# EAGLE schematic SparkFunLargeDigitDriver (EAGLE 7.2.0)
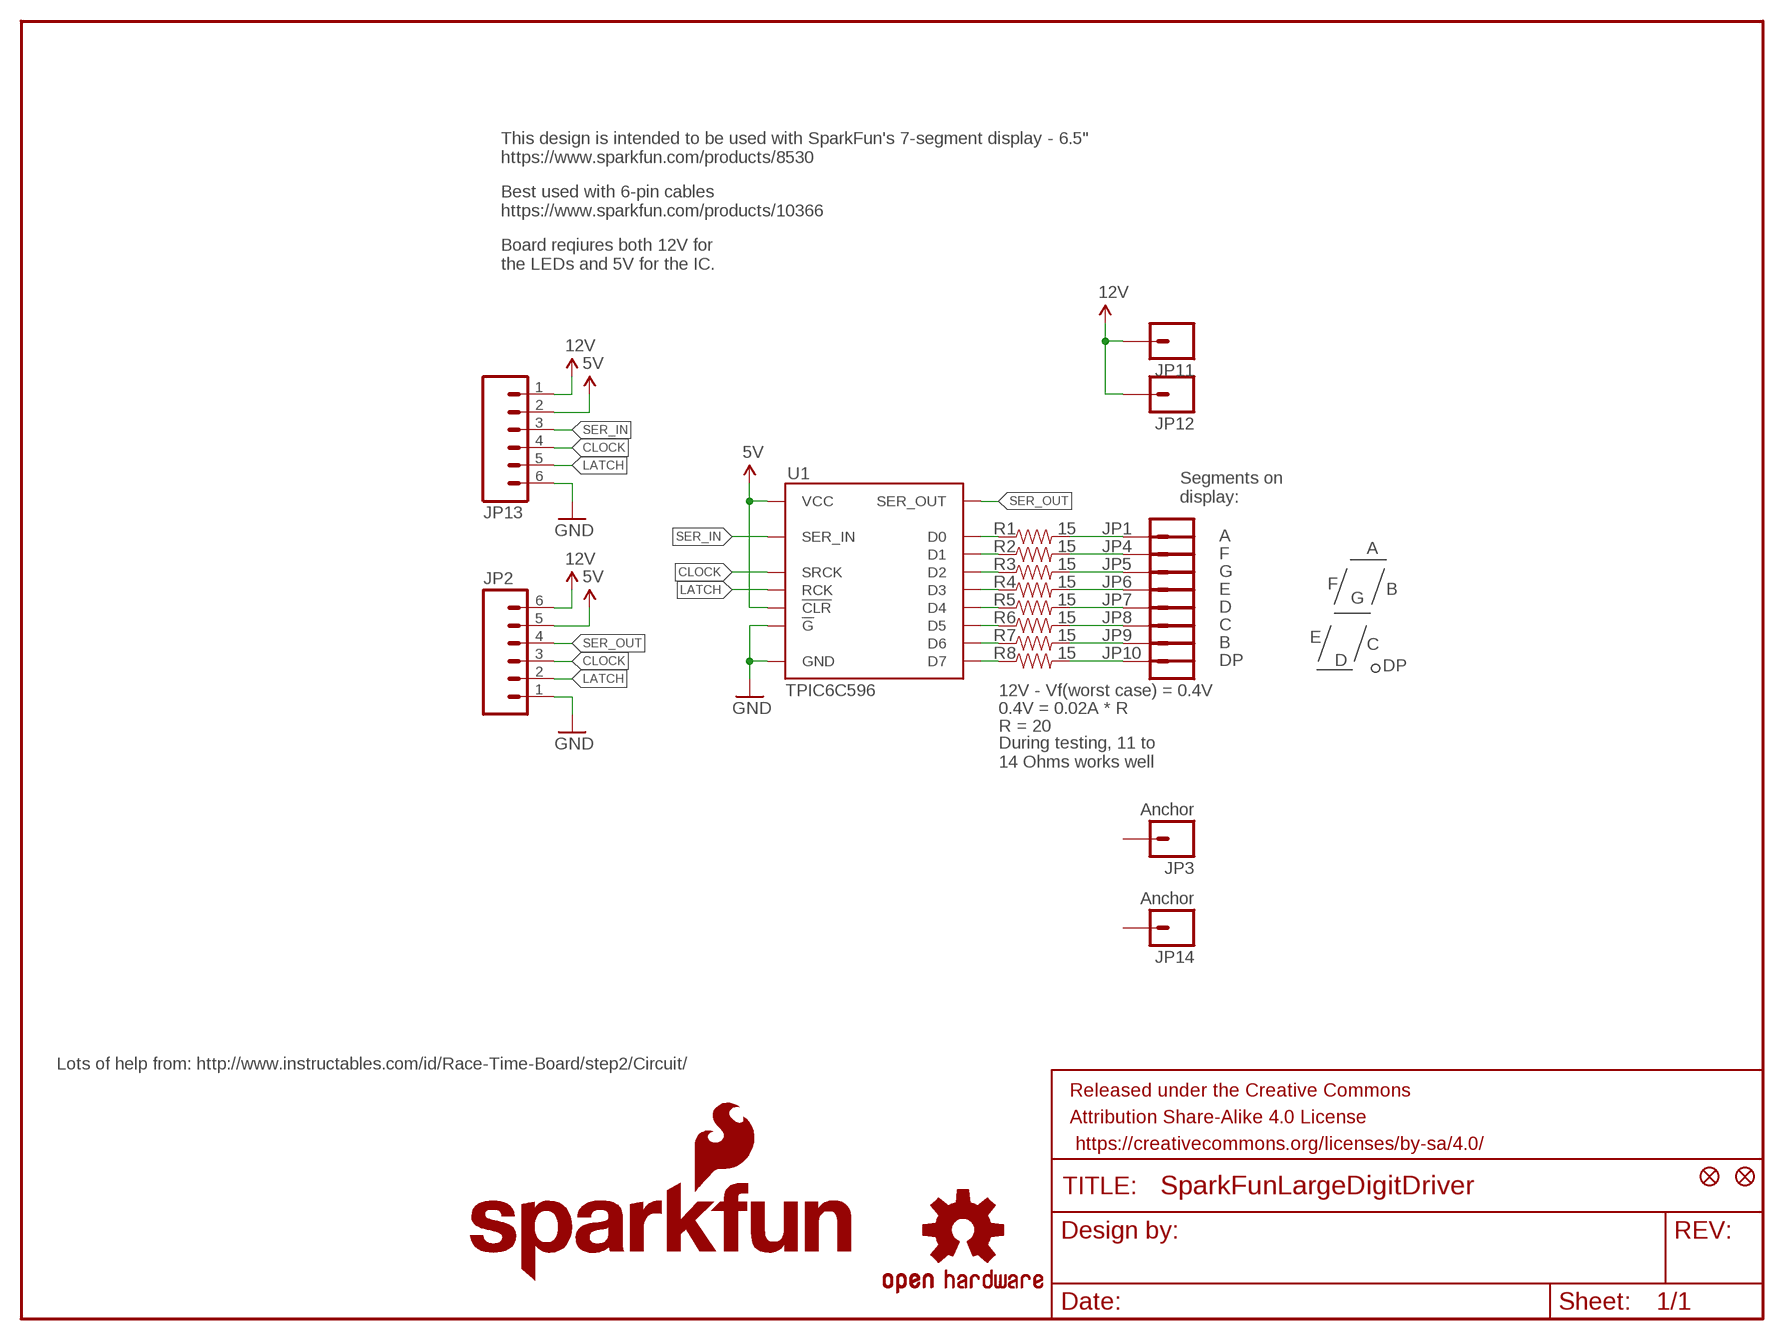
[diagram p0: schematic, sheet 1]

## Parts
FID1  FIDUCIAL1X2  [FIDUCIAL-1X2]
FID2  FIDUCIAL1X2  [FIDUCIAL-1X2]
FRAME1  FRAME-LETTER  [CREATIVE_COMMONS]
JP1  M01PTH_LONGPAD  [1X01_LONGPAD]
JP2  M06SMD  [1X06-SMD]
JP3  Anchor  M01PTH_LONGPAD  [1X01_LONGPAD]
JP4  M01PTH_LONGPAD  [1X01_LONGPAD]
JP5  M01PTH_LONGPAD  [1X01_LONGPAD]
JP6  M01PTH_LONGPAD  [1X01_LONGPAD]
JP7  M01PTH_LONGPAD  [1X01_LONGPAD]
JP8  M01PTH_LONGPAD  [1X01_LONGPAD]
JP9  M01PTH_LONGPAD  [1X01_LONGPAD]
JP10  M01PTH_LONGPAD  [1X01_LONGPAD]
JP11  M01PTH_LONGPAD  [1X01_LONGPAD]
JP12  M01PTH_LONGPAD  [1X01_LONGPAD]
JP13  M06SMD  [1X06-SMD]
JP14  Anchor  M01PTH_LONGPAD  [1X01_LONGPAD]
LOGO1  SFE_LOGO_NAME_FLAME.1_INCH  [SFE_LOGO_NAME_FLAME_.1]
LOGO2  OSHW-LOGOS  [OSHW-LOGO-S]
R1  15  15OHM-1/10W-1%(0603)0603  [0603-RES]
R2  15  15OHM-1/10W-1%(0603)0603  [0603-RES]
R3  15  15OHM-1/10W-1%(0603)0603  [0603-RES]
R4  15  15OHM-1/10W-1%(0603)0603  [0603-RES]
R5  15  15OHM-1/10W-1%(0603)0603  [0603-RES]
R6  15  15OHM-1/10W-1%(0603)0603  [0603-RES]
R7  15  15OHM-1/10W-1%(0603)0603  [0603-RES]
R8  15  15OHM-1/10W-1%(0603)0603  [0603-RES]
U1  TPIC6C596  TPIC6C596SOIC  [SO016]

## Nets
5V: JP2.5 JP13.2 U1.1(VCC) U1.7(!CLR)
12V: JP2.6 JP11.1 JP12.1 JP13.1
CLOCK: JP2.3 JP13.4 U1.15(SRCK)
D0: R1.1 U1.3(D0)
D1: R2.1 U1.4(D1)
D2: R3.1 U1.5(D2)
D3: R4.1 U1.6(D3)
D4: R5.1 U1.11(D4)
D5: R6.1 U1.12(D5)
D6: R7.1 U1.13(D6)
D7: R8.1 U1.14(D7)
GND: JP2.1 JP13.6 U1.8(!G) U1.16(GND)
LATCH: JP2.2 JP13.5 U1.10(RCK)
S0: JP1.1 R1.2
S1: JP4.1 R2.2
S2: JP5.1 R3.2
S3: JP6.1 R4.2
S4: JP7.1 R5.2
S5: JP8.1 R6.2
S6: JP9.1 R7.2
S7: JP10.1 R8.2
SER_IN: JP13.3 U1.2(SER_IN)
SER_OUT: JP2.4 U1.9(SER_OUT)
Unconnected: JP3.1 JP14.1

## Notes on the sheet
- This design is intended to be used with SparkFun's 7-segment display - 6.5"
  https://www.sparkfun.com/products/8530
- Best used with 6-pin cables
  https://www.sparkfun.com/products/10366
- Board reqiures both 12V for 
  the LEDs and 5V for the IC.
- Segments on
  display:
- A
- A
- F
- G
- F
- E | B
- G
- D
- C
- E
- B | C
- DP | D
- DP
- 12V - Vf(worst case) = 0.4V
- 0.4V = 0.02A * R
- R = 20
- During testing, 11 to 
  14 Ohms works well
- Lots of help from: http://www.instructables.com/id/Race-Time-Board/step2/Circuit/

## Library data of the parts
FID1 FID2 = SparkFun-Aesthetics:FIDUCIAL: Fiducial Alignment Points Various fiducial points for machine vision alignment.
FRAME1 = SparkFun-Aesthetics:FRAME-LETTER: Schematic Frame Standard 8.5x11 US Letter frame; DESIGNER: N. Seidle; VERSION: v10
JP1 JP3-JP12 JP14 = SparkFun-Connectors:M01: Header 1 Standard 1-pin 0.1" header. Use with straight break away headers (SKU : PRT-00116), right angle break away headers (PRT-00553), swiss pins (PRT-00743), machine pins (PRT-00117), and female headers (PRT-00115).
JP2 JP13 = SparkFun-Connectors:M06: Header 6 Standard 6-pin 0.1" header. Use with straight break away headers (SKU : PRT-00116), right angle break away headers (PRT-00553), swiss pins (PRT-00743), machine pins (PRT-00117), and female headers (PRT-00115). Molex polarized connector foot print use with SKU : PRT-08094 with associated crimp pins and housings. NOTES ON THE VARIANTS LOCK and LOCK_LONGPADS... This footprint was designed to help hold the alignment of a through-hole component (i.e. 6-pin header) while soldering it into place. You may notice that each hole has been shifted either up or down by 0.005 of an inch from it's more standard position (which is a perfectly straight line). This slight alteration caused the pins (the squares in the middle) to touch the edges of the holes. Because they are alternating, it causes a "brace" to hold the component in place. 0.005 has proven to be the perfect amount of "off-center" position when using our standard breakaway headers. Although looks a little odd when you look at the bare footprint, once you have a header in there, the alteration is very hard to notice. Also,if you push a header all the way into place, it is covered up entirely on the bottom side. This idea of altering the position of holes to aid alignment will be further integrated into the Sparkfun Library for other footprints. It can help hold any component with 3 or more connection pins.; PROD_ID: CONN-08971; VALUE: RA 6Pin SMD
LOGO1 = SparkFun-Aesthetics:SFE_LOGO_NAME_FLAME: SFE Logo, name and flame This is the SparkFun full logo. The logo on the schematic will always be the same size; the package variant is the height of the flame part of the logo. Default layer for the logo on the board is tSilk.
LOGO2 = SparkFun-Aesthetics:OSHW-LOGO: Open Source Hardware Logo This logo indicates the piece of hardware it is found on incorporates a OSHW license and/or adheres to the definition of open source hardware found here: http://freedomdefined.org/OSHW
R1-R8 = SparkFun-Resistors:15OHM-1/10W-1%(0603); PROD_ID: RES-12570
U1 = SparkFun-DigitalIC:TPIC6C596: SMD version of the popular sink driver. This version can sink up to 100mA per channel; PROD_ID: IC-12522

## Net classes
1 power: width 0.203 mm